# Altium schematic sheet STM32F103CBU6.SchDoc
size A
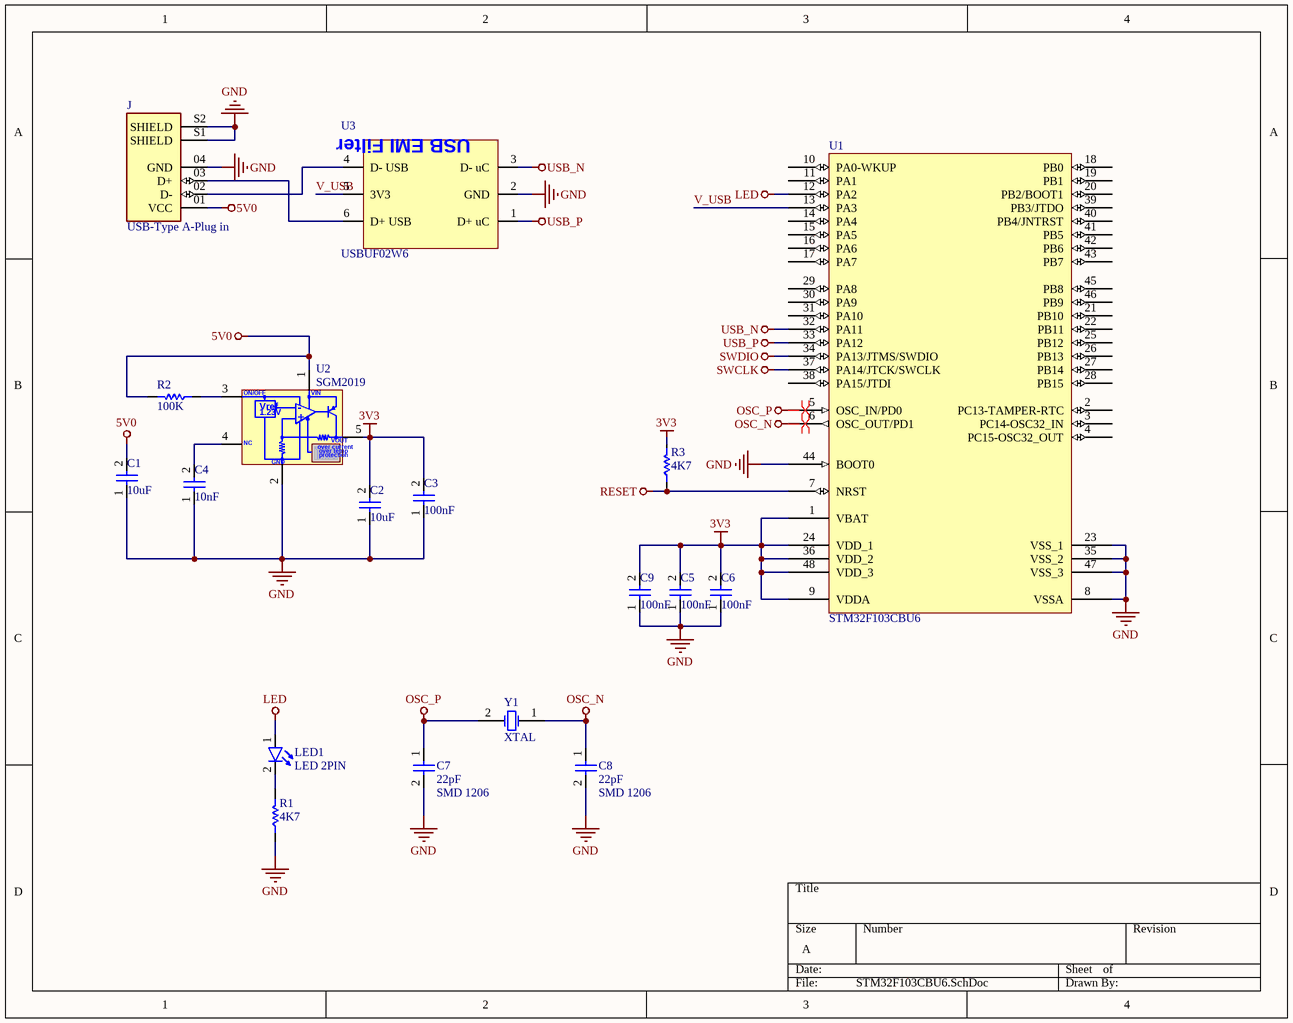
[diagram p0: STM32F103CBU6.SchDoc]

## Parts
C1  10uF  [SMD 0805]
C2  10uF  [SMD 0805]
C3  100nF  [SMD 0805]
C4  10nF  [SMD 0805]
C5  100nF  [SMD 0805]
C6  100nF  [SMD 0805]
C7  22pF  [SMD 0805]
C8  22pF  [SMD 0805]
C9  100nF  [SMD 0805]
J  USB-Type A-Plug in  [USB-TypeA-PlugIn]
LED1  LED 2PIN  [LED 0805]
R1  4K7  [0805_1/8W]
R2  100K  [0805_1/8W]
R3  4K7  [0805_1/8W]
U1  STM32F103CBU6  [QFN50P700X700X60-49N]
U2  SGM2019  [TSOT23]
U3  USBUF02W6  [SOT323 6-Lead]
Y1  XTAL  [XTAL YIC 8.0000]

## Nets
3V3: C2.2 C3.2 C5.2 C6.2 C9.2 R3.2 U1.1(VBAT) U1.9(VDDA) U1.24(VDD_1) U1.36(VDD_2) U1.48(VDD_3) U2.5(VOUT)
5V0: C1.2 J.01(VCC) R2.2 U2.1(VIN)
GND: C1.1 C2.1 C3.1 C4.1 C5.1 C6.1 C7.2 C8.2 C9.1 J.04(GND) J.S1(SHIELD) J.S2(SHIELD) R1.1 U1.8(VSSA) U1.23(VSS_1) U1.35(VSS_2) U1.44(BOOT0) U1.47(VSS_3) U2.2(GND) U3.2(GND)
LED: LED1.1(A) U1.12(PA2)
OSC_N: C8.1 U1.6(OSC_OUT/PD1) Y1.1(OSC1)
OSC_P: C7.1 U1.5(OSC_IN/PD0) Y1.2(OSC2)
RESET: R3.1 U1.7(NRST)
SWCLK: U1.37(PA14/JTCK/SWCLK)
SWDIO: U1.34(PA13/JTMS/SWDIO)
USB_N: U1.32(PA11) U3.3(D-_uC)
USB_P: U1.33(PA12) U3.1(D+_uC)
V_USB: U1.13(PA3) U3.5(3V3)
NetC4_2: C4.2 U2.4(NC)
NetJ_02: J.02(D-) U3.4(D-_USB)
NetJ_03: J.03(D+) U3.6(D+_USB)
NetLED1_2: LED1.2(K) R1.2
NetR2_1: R2.1 U2.3(ON/OFF)

Not connected (* = marked no-connect by the designer): U1 2(PC13-TAMPER-RTC) 3(PC14-OSC32_IN) 4(PC15-OSC32_OUT) 10(PA0-WKUP) 11(PA1) 14(PA4) 15(PA5) 16(PA6) 17(PA7) 18(PB0) 19(PB1) 20(PB2/BOOT1) 21(PB10) 22(PB11) 25(PB12) 26(PB13) 27(PB14) 28(PB15) 29(PA8) 30(PA9) 31(PA10) 38(PA15/JTDI) 39(PB3/JTDO) 40(PB4/JNTRST) 41(PB5) 42(PB6) 43(PB7) 45(PB8) 46(PB9)

## Layout directives
differential pair: OSC_N, OSC_P

## Notes on the sheet
- (in symbol CAP NON) SMD 1206
- (in symbol L2980) Vref; 1.23V; -; +; over current; over temp; protection
- (in symbol USBUF02W6) USB EMI Filter

## Library data of the parts
C1-C9 = CAP NON
J = USB-AM-S-X-X-TH: USB-A (USB TYPE-A) USB 2.0 Plug Connector 4 Position Through Hole, Right Angle; MF: Samtec; MP: USB-AM-S-F-B-TH; Toby_UK-Purchase-URL: https://snapeda.com/shop?store=Toby+UK&id=474273; Price: None; SnapEDA_Link: https://www.snapeda.com/parts/USB-AM-S-F-B-TH/Samtec%20Inc./view-part/474273/?ref=snap; Availability: Unavailable; Package: None; Value: *
R1-R3 = RESISTOR
U1 = STM32F103CBT6: STM32 ARM-based 32-bit MCU with 128 Kbytes Flash, 48-pin LQFP, Industrial Temperature; Published: *; DatasheetVersion: *; PackageVersion: *; PackageReference: *; Publisher: *; PackageDescription: *; ComponentLink1Description: *; ComponentLink1URL: *; ComponentLink2Description: *; ComponentLink2URL: *
U2 = L2980